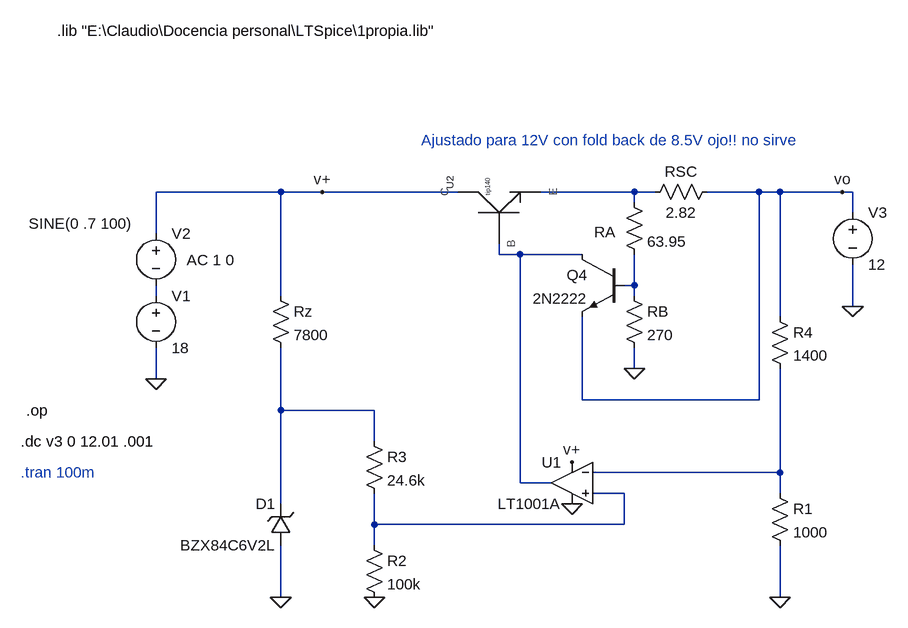
[diagram p0: schematic regulador4_4.asc]
regulador4_4.asc, the LTspice schematic file:
Version 4
SHEET 1 1316 680
WIRE 224 -48 32 -48
WIRE 288 -48 224 -48
WIRE 496 -48 288 -48
WIRE 768 -48 624 -48
WIRE 800 -48 768 -48
WIRE 960 -48 880 -48
WIRE 992 -48 960 -48
WIRE 1088 -48 992 -48
WIRE 1104 -48 1088 -48
WIRE 768 -32 768 -48
WIRE 1104 -16 1104 -48
WIRE 32 16 32 -48
WIRE 560 48 560 32
WIRE 592 48 560 48
WIRE 688 48 592 48
WIRE 768 96 768 48
WIRE 768 96 752 96
WIRE 32 112 32 96
WIRE 224 112 224 -48
WIRE 768 112 768 96
WIRE 1104 128 1104 64
WIRE 992 144 992 -48
WIRE 768 224 768 192
WIRE 32 240 32 192
WIRE 688 272 688 144
WIRE 960 272 960 -48
WIRE 960 272 688 272
WIRE 224 288 224 192
WIRE 368 288 224 288
WIRE 368 336 368 288
WIRE 992 384 992 224
WIRE 992 384 704 384
WIRE 592 400 592 48
WIRE 640 400 592 400
WIRE 752 416 704 416
WIRE 992 416 992 384
WIRE 224 432 224 288
WIRE 368 464 368 416
WIRE 752 464 752 416
WIRE 752 464 368 464
WIRE 368 496 368 464
WIRE 224 576 224 496
WIRE 992 576 992 496
FLAG 32 240 0
FLAG 224 576 0
FLAG 992 576 0
FLAG 1104 128 0
FLAG 1088 -48 vo
FLAG 768 224 0
FLAG 288 -48 v+
FLAG 672 368 v+
FLAG 672 432 0
FLAG 368 576 0
DATAFLAG 992 -48 ""
DATAFLAG 992 304 ""
DATAFLAG 224 304 ""
DATAFLAG 592 240 ""
DATAFLAG 384 -48 ""
DATAFLAG 688 -48 ""
DATAFLAG 480 464 ""
SYMBOL voltage 32 96 R0
WINDOW 123 0 0 Left 2
WINDOW 39 0 0 Left 2
SYMATTR InstName V1
SYMATTR Value 18
SYMBOL voltage 32 0 R0
WINDOW 123 47 57 Left 2
WINDOW 39 0 0 Left 2
WINDOW 3 -196 1 Left 2
SYMATTR Value2 AC 1 0
SYMATTR Value SINE(0 .7 100)
SYMATTR InstName V2
SYMBOL res 208 96 R0
SYMATTR InstName Rz
SYMATTR Value 7800
SYMBOL zener 240 496 R180
WINDOW 0 24 64 Left 2
WINDOW 3 24 0 Left 2
SYMATTR InstName D1
SYMATTR Value BZX84C6V2L
SYMATTR Description Diode
SYMATTR Type diode
SYMBOL res 976 400 R0
SYMATTR InstName R1
SYMATTR Value 1000
SYMBOL npn 752 48 M0
SYMATTR InstName Q4
SYMATTR Value 2N2222
SYMBOL res 896 -64 R90
WINDOW 0 0 56 VBottom 2
WINDOW 3 32 56 VTop 2
SYMATTR InstName RSC
SYMATTR Value 2.82
SYMBOL res 752 -48 R0
WINDOW 0 -46 62 Left 2
SYMATTR InstName RA
SYMATTR Value 63.95
SYMBOL res 752 96 R0
SYMATTR InstName RB
SYMATTR Value 270
SYMBOL OpAmps\\LT1001A 672 336 M0
SYMATTR InstName U1
SYMBOL Propia\\Darlington\ npn 560 -16 R270
SYMATTR Value tip140
SYMATTR InstName U2
SYMBOL res 352 480 R0
SYMATTR InstName R2
SYMATTR Value 100k
SYMBOL res 352 320 R0
SYMATTR InstName R3
SYMATTR Value 24.6k
SYMBOL res 976 128 R0
SYMATTR InstName R4
SYMATTR Value 1400
SYMBOL voltage 1104 -32 R0
WINDOW 123 0 0 Left 0
WINDOW 39 0 0 Left 0
SYMATTR InstName V3
SYMATTR Value 12
TEXT -168 288 Left 2 !.op
TEXT -176 336 Left 2 !.dc v3 0 12.01 .001
TEXT -120 -296 Left 2 !.lib "E:\\Claudio\\Docencia personal\\LTSpice\\1propia.lib"
TEXT -176 384 Left 2 ;.tran 100m
TEXT 440 -128 Left 2 ;Ajustado para 12V con fold back de 8.5V ojo!! no sirve

The netlist it stands for:
* regulador4_4.asc
V1 N004 0 18
V2 v+ N004 SINE(0 .7 100) AC 1 0
Rz v+ N005 7800
D1 0 N005 BZX84C6V2L
R1 N006 0 1000
Q4 N002 N003 vo 0 2N2222
RSC vo N001 2.82
RA N001 N003 63.95
RB N003 0 270
XU1 N007 N006 v+ 0 N002 LT1001  ; LT1001A, pins In+ In- V+ V- OUT
XU2 v+ N002 N001 tip140  ; pins C B E
R2 N007 0 100k
R3 N005 N007 24.6k
R4 vo N006 1400
V3 vo 0 12
.model D D
.lib standard.dio
.model NPN NPN
.model PNP PNP
.lib standard.bjt
.op
.dc v3 0 12.01 .001
.lib "E:\Claudio\Docencia personal\LTSpice\1propia.lib"
* .tran 100m
* Ajustado para 12V con fold back de 8.5V ojo!! no sirve
.lib LTC.lib
.backanno
.end